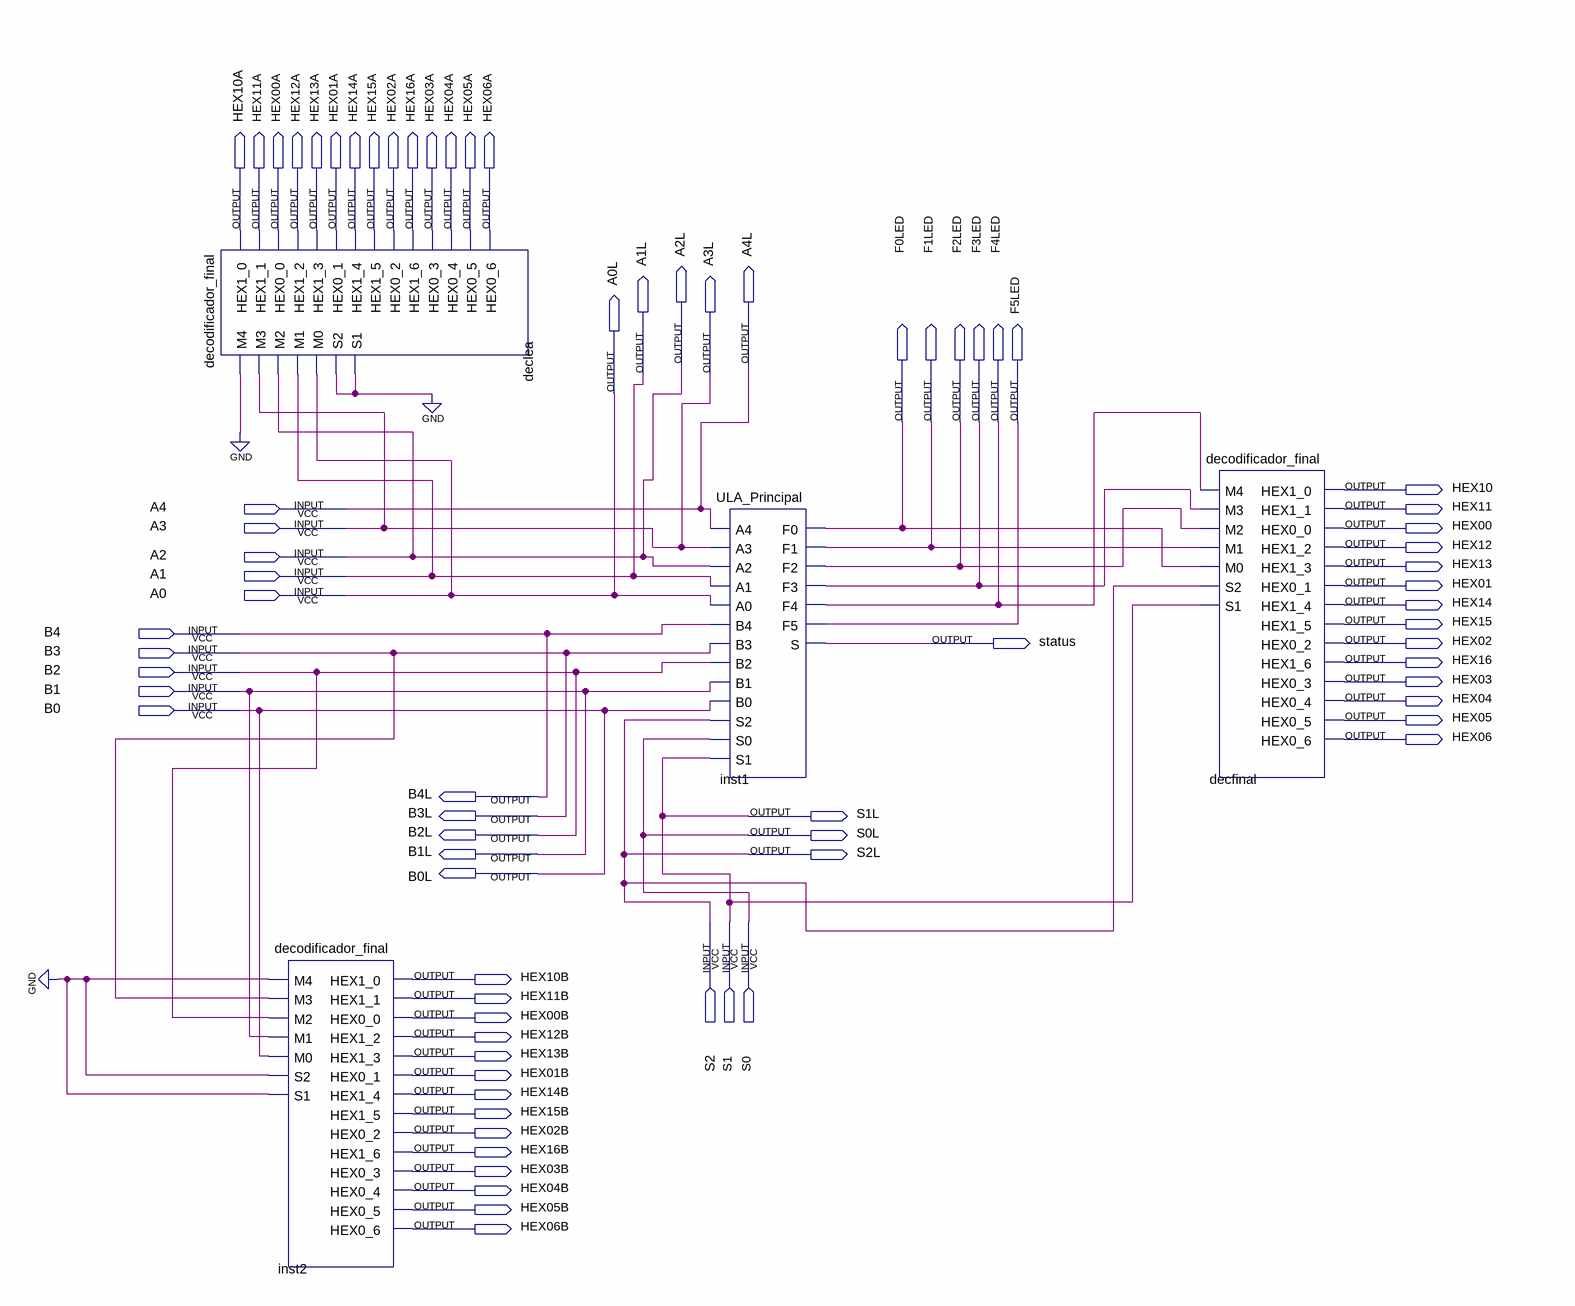
[diagram p0: schematic sheet]
// Quartus schematic geral.bdf as structural Verilog: 4 symbols, 75 pins
module geral (
  input  A4,
  input  A3,
  input  A2,
  input  A1,
  input  A0,
  input  B4,
  input  B3,
  input  B2,
  input  B1,
  input  B0,
  input  S2,
  input  S1,
  input  S0,
  output HEX10A,
  output HEX11A,
  output HEX00A,
  output HEX12A,
  output HEX13A,
  output HEX01A,
  output HEX14A,
  output HEX15A,
  output HEX02A,
  output HEX16A,
  output HEX03A,
  output HEX04A,
  output HEX05A,
  output HEX06A,
  output A2L,
  output A4L,
  output A1L,
  output A3L,
  output A0L,
  output F0LED,
  output F1LED,
  output F2LED,
  output F3LED,
  output F4LED,
  output F5LED,
  output HEX10,
  output HEX11,
  output HEX00,
  output HEX12,
  output HEX13,
  output HEX01,
  output HEX14,
  output HEX15,
  output status,
  output HEX02,
  output HEX16,
  output HEX03,
  output HEX04,
  output HEX05,
  output HEX06,
  output B4L,
  output B3L,
  output S1L,
  output B2L,
  output S0L,
  output B1L,
  output S2L,
  output B0L,
  output HEX10B,
  output HEX11B,
  output HEX00B,
  output HEX12B,
  output HEX13B,
  output HEX01B,
  output HEX14B,
  output HEX15B,
  output HEX02B,
  output HEX16B,
  output HEX03B,
  output HEX04B,
  output HEX05B,
  output HEX06B
);

  decodificador_final declea (
    .M4(1'b0), .M3(A3), .M2(A2), .M1(A1), .M0(A0), .S2(1'b0), .S1(1'b0), .HEX1_0(HEX10A), .HEX1_1(HEX11A),
    .HEX0_0(HEX00A), .HEX1_2(HEX12A), .HEX1_3(HEX13A), .HEX0_1(HEX01A), .HEX1_4(HEX14A), .HEX1_5(HEX15A),
    .HEX0_2(HEX02A), .HEX1_6(HEX16A), .HEX0_3(HEX03A), .HEX0_4(HEX04A), .HEX0_5(HEX05A), .HEX0_6(HEX06A));
  decodificador_final inst2 (
    .M4(1'b0), .M3(B3), .M2(B2), .M1(B1), .M0(B0), .S2(1'b0), .S1(1'b0), .HEX1_0(HEX10B), .HEX1_1(HEX11B),
    .HEX0_0(HEX00B), .HEX1_2(HEX12B), .HEX1_3(HEX13B), .HEX0_1(HEX01B), .HEX1_4(HEX14B), .HEX1_5(HEX15B),
    .HEX0_2(HEX02B), .HEX1_6(HEX16B), .HEX0_3(HEX03B), .HEX0_4(HEX04B), .HEX0_5(HEX05B), .HEX0_6(HEX06B));
  ULA_Principal inst1 (
    .A4(A4), .A3(A3), .A2(A2), .A1(A1), .A0(A0), .B4(B4), .B3(B3), .B2(B2), .B1(B1), .B0(B0), .S2(S2),
    .S0(S0), .S1(S1), .F0(F0LED), .F1(F1LED), .F2(F2LED), .F3(F3LED), .F4(F4LED), .F5(F5LED), .S(status));
  decodificador_final decfinal (
    .M4(F4LED), .M3(F3LED), .M2(F2LED), .M1(F1LED), .M0(F0LED), .S2(S2), .S1(S1), .HEX1_0(HEX10),
    .HEX1_1(HEX11), .HEX0_0(HEX00), .HEX1_2(HEX12), .HEX1_3(HEX13), .HEX0_1(HEX01), .HEX1_4(HEX14),
    .HEX1_5(HEX15), .HEX0_2(HEX02), .HEX1_6(HEX16), .HEX0_3(HEX03), .HEX0_4(HEX04), .HEX0_5(HEX05),
    .HEX0_6(HEX06));

  assign A0L = A0;
  assign A1L = A1;
  assign A2L = A2;
  assign A3L = A3;
  assign A4L = A4;
  assign B0L = B0;
  assign B1L = B1;
  assign B2L = B2;
  assign B3L = B3;
  assign B4L = B4;
  assign S0L = S0;
  assign S1L = S1;
  assign S2L = S2;
endmodule
